# Altium project belt_control.PrjPCB
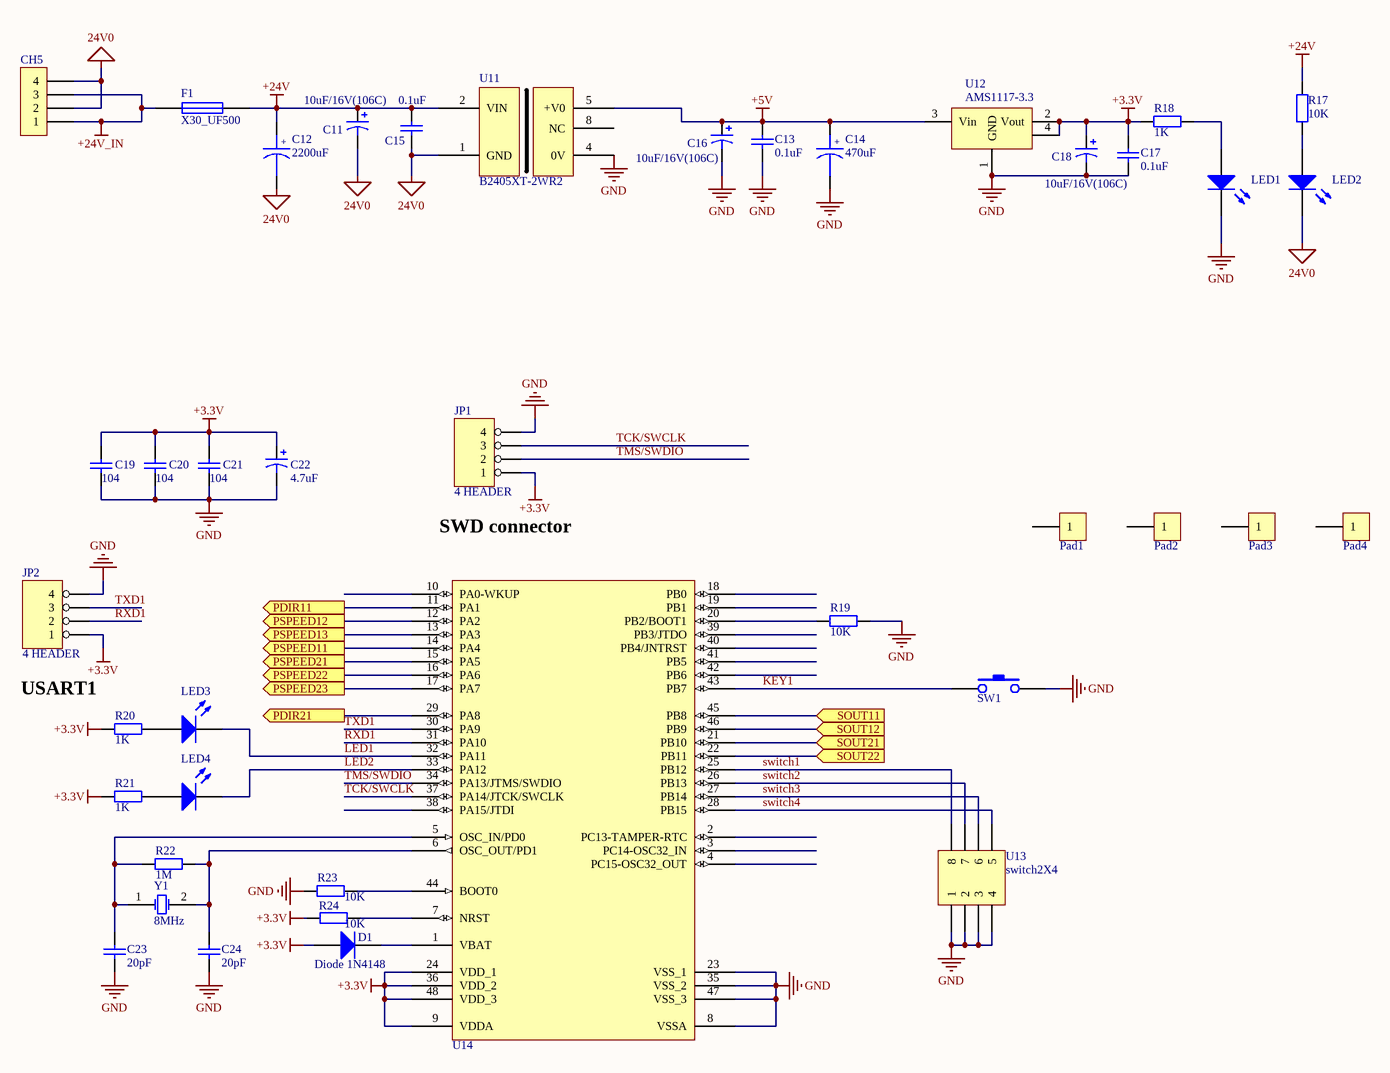
[diagram p0: power_cpu.SchDoc]
3 sheets, 118 parts. Net scope: flat (ports and power ports of the same name join across sheets).
Board file: belt_control.PcbDoc
Sheets:
  power_cpu.SchDoc
  belt_output.SchDoc
  senror_input.SchDoc

## Sheet power_cpu.SchDoc
size A3

### Parts
C11  value 10uF/16V(106C)  [CAP A-3216]  (hidden comment: Cap Pol3)
C12  C_2200uF  [C7.8*17]  (value not drawn)
C13  value 0.1uF  [0805]  (hidden comment: Cap)
C14  C_2200uF  [C5*10]  (value not drawn)
C15  value 0.1uF  [0805]  (hidden comment: Cap)
C16  value 10uF/16V(106C)  [CAP A-3216]  (hidden comment: Cap Pol3)
C17  value 0.1uF  [0805]  (hidden comment: Cap)
C18  value 10uF/16V(106C)  [CAP A-3216]  (hidden comment: Cap Pol3)
C19  value 104  [C0805tan]  (hidden comment: Cap)
C20  value 104  [C0805tan]  (hidden comment: Cap)
C21  value 104  [C0805tan]  (hidden comment: Cap)
C22  value 4.7uF  [3225[1210]]  (hidden comment: Cap Pol1)
C23  value 20pF  [C0805tan]  (hidden comment: Cap)
C24  value 20pF  [C0805tan]  (hidden comment: Cap)
CH5  HEADER1X4  [CH3.96-4PIN]  (value not drawn)
D1  Diode 1N4148  [LL34]
F1  X30_UF500  [X30UF600]
JP1  4 HEADER  [CON4_1.5]
JP2  4 HEADER  [HDR1X4]
LED1  (no value)  [LED-0805]
LED2  (no value)  [LED-0805]
LED3  (no value)  [LED-0805]
LED4  (no value)  [LED-0805]
Pad1  Pad  [pad35]  (value not drawn)
Pad2  Pad  [pad35]  (value not drawn)
Pad3  Pad  [pad35]  (value not drawn)
Pad4  Pad  [pad35]  (value not drawn)
R17  value 10K  [0805]  (hidden comment: Res2)
R18  value 1K  [0805]  (hidden comment: Res2)
R19  value 10K  [C0805tan]  (hidden comment: Res2)
R20  value 1K  [0805]  (hidden comment: Res2)
R21  value 1K  [0805]  (hidden comment: Res2)
R22  value 1M  [C0805tan]  (hidden comment: Res2)
R23  value 10K  [C0805tan]  (hidden comment: Res2)
R24  value 10K  [C0805tan]  (hidden comment: Res2)
SW1  SW-KEY-2  [KEY_SOP4]  (value not drawn)
U11  B2405XT-2WR2  [B2405XT-2WR2]
U12  AMS1117-3.3  [SOT223]
U13  switch2X4  [SOP8_switch]
U14  STM32F103C8T6  [LQFP48]  (value not drawn)
Y1  8MHz  [XTAL_US]

### Ports
PDIR11 (out), PDIR21 (out), PSPEED11 (out), PSPEED12 (out), PSPEED13 (out), PSPEED21 (out), PSPEED22 (out), PSPEED23 (out), SOUT11 (in), SOUT12 (in), SOUT21 (in), SOUT22 (in)

### Nets
24V0: C11.2 C12.2 C15.1 CH5.2 CH5.4 LED2.2(K) U11.1(GND)
+3.3V: C17.2 C18.1 C19.2 C20.2 C21.2 C22.1 D1.1(A) JP1.1 JP2.1 R18.2 R20.2 R21.2 R24.1 U12.2(Vout) U12.4 U14.9(VDDA) U14.24(VDD_1) U14.36(VDD_2) U14.48(VDD_3)
+5V: C13.2 C14.1 C16.1 U11.5(+V0) U12.3(Vin)
+24V: C11.1 C12.1 C15.2 F1.2 R17.2 U11.2(VIN)
+24V_IN: CH5.1 CH5.3 F1.1
GND: C13.1 C14.2 C16.2 C17.1 C18.2 C19.1 C20.1 C21.1 C22.2 C23.1 C24.1 JP1.4 JP2.4 LED1.2(K) R19.2 R23.1 SW1.2 U11.4(0V) U12.1(GND) U13.1 U13.2 U13.3 U13.4 U14.8(VSSA) U14.23(VSS_1) U14.35(VSS_2) U14.47(VSS_3)
KEY1: SW1.1 U14.43(PB7)
LED1: LED3.2(K) U14.32(PA11)
LED2: LED4.2(K) U14.33(PA12)
RXD1: JP2.2 U14.31(PA10)
switch1: U13.8 U14.25(PB12)
switch2: U13.7 U14.26(PB13)
switch3: U13.6 U14.27(PB14)
switch4: U13.5 U14.28(PB15)
TCK/SWCLK: JP1.3 U14.37(PA14/JTCK/SWCLK)
TMS/SWDIO: JP1.2 U14.34(PA13/JTMS/SWDIO)
TXD1: JP2.3 U14.30(PA9)
NetC23_2: C23.2 R22.1 U14.5(OSC_IN/PD0) Y1.1(OSC1)
NetC24_2: C24.2 R22.2 U14.6(OSC_OUT/PD1) Y1.2(OSC2)
NetC26_2: U14.46(PB9) ; port SOUT12
NetC28_2: U14.45(PB8) ; port SOUT11
NetC33_2: U14.22(PB11) ; port SOUT22
NetC35_2: U14.21(PB10) ; port SOUT21
NetD1_2: D1.2(K) U14.1(VBAT)
NetLED1_1: LED1.1(A) R18.1
NetLED2_1: LED2.1(A) R17.1
NetLED3_1: LED3.1(A) R20.1
NetLED4_1: LED4.1(A) R21.1
NetR3_1: U14.14(PA4) ; port PSPEED11
NetR4_1: U14.13(PA3) ; port PSPEED13
NetR7_1: U14.12(PA2) ; port PSPEED12
NetR8_1: U14.11(PA1) ; port PDIR11
NetR11_1: U14.15(PA5) ; port PSPEED21
NetR12_1: U14.17(PA7) ; port PSPEED23
NetR15_1: U14.16(PA6) ; port PSPEED22
NetR16_1: U14.29(PA8) ; port PDIR21
NetR19_1: R19.1 U14.20(PB2/BOOT1)
NetR23_2: R23.2 U14.44(BOOT0)
NetR24_2: R24.2 U14.7(NRST)

Not connected (* = marked no-connect by the designer): Pad1 1; Pad2 1; Pad3 1; Pad4 1; U11 8(NC); U14 2(PC13-TAMPER-RTC) 3(PC14-OSC32_IN) 4(PC15-OSC32_OUT) 10(PA0-WKUP) 18(PB0) 19(PB1) 38(PA15/JTDI) 39(PB3/JTDO) 40(PB4/JNTRST) 41(PB5) 42(PB6)

### Notes on the sheet
- SWD connector
- USART1
- (in symbol C_2200uF) +; 2200uF; 470uF

### Library data of the parts
C11 C16 C18 = Cap Pol3: Polarized Capacitor (Surface Mount); Published: 8-Jun-2000; LatestRevisionDate: 17-Jul-2002; LatestRevisionNote: Re-released for DXP Platform.; PackageReference: C0805; Publisher: Altium Limited
C13 C15 C17 C19-C21 C23 C24 = Cap: Capacitor; Published: 8-Jun-2000; LatestRevisionDate: 17-Jul-2002; LatestRevisionNote: Re-released for DXP Platform.; Publisher: Altium Limited
  C13 C15 C17 C19-C21: PackageReference: RAD-0.3
C22 = Cap Pol1: Polarized Capacitor (Radial); Published: 8-Jun-2000; LatestRevisionDate: 17-Jul-2002; LatestRevisionNote: Re-released for DXP Platform.; PackageReference: RB7.6-15; Publisher: Altium Limited
D1 = Diode 1N4148: High Conductance Fast Diode; Published: 8-Jun-2000; LatestRevisionDate: 17-Jul-2002; LatestRevisionNote: Re-released for DXP Platform.; DatasheetDocument: 1997; PackageReference: DO-35; Publisher: Altium Limited; Code_JEDEC: DO-204-AH; ComponentLink1Description: Manufacturer Link; ComponentLink1URL: http://www.fairchildsemi.com/; ComponentLink2Description: Datasheet; ComponentLink2URL: http://www.fairchildsemi.com/ds/1N%2F1N4148.pdf
F1 = Fuse 1: Fuse; Published: 8-Jun-2000; LatestRevisionDate: 17-Jul-2002; LatestRevisionNote: Re-released for DXP Platform.; PackageReference: PIN-W2/E2.8; Publisher: Altium Limited
JP1 JP2 = 4 HEADER: 4 Pin Header
LED1-LED4 = LED2: Typical RED, GREEN, YELLOW, AMBER GaAs LED; Published: 8-Jun-2000; LatestRevisionDate: 17-Jul-2002; LatestRevisionNote: Re-released for DXP Platform.; PackageDocument: Feb-2002; PackageReference: 3.2X1.6X1.1; Publisher: Altium Limited
R17-R24 = Res2: Resistor; Published: 8-Jun-2000; LatestRevisionDate: 17-Jul-2002; LatestRevisionNote: Re-released for DXP Platform.; Publisher: Altium Limited
  R17 R18 R20 R21: PackageReference: AXIAL-0.4
U12 = AMS1117-5
Y1 = XTAL: Crystal Oscillator; Published: 8-Jun-2000; LatestRevisionDate: 17-Jul-2002; LatestRevisionNote: Re-released for DXP Platform.; Publisher: Altium Limited

## Sheet belt_output.SchDoc
size A3
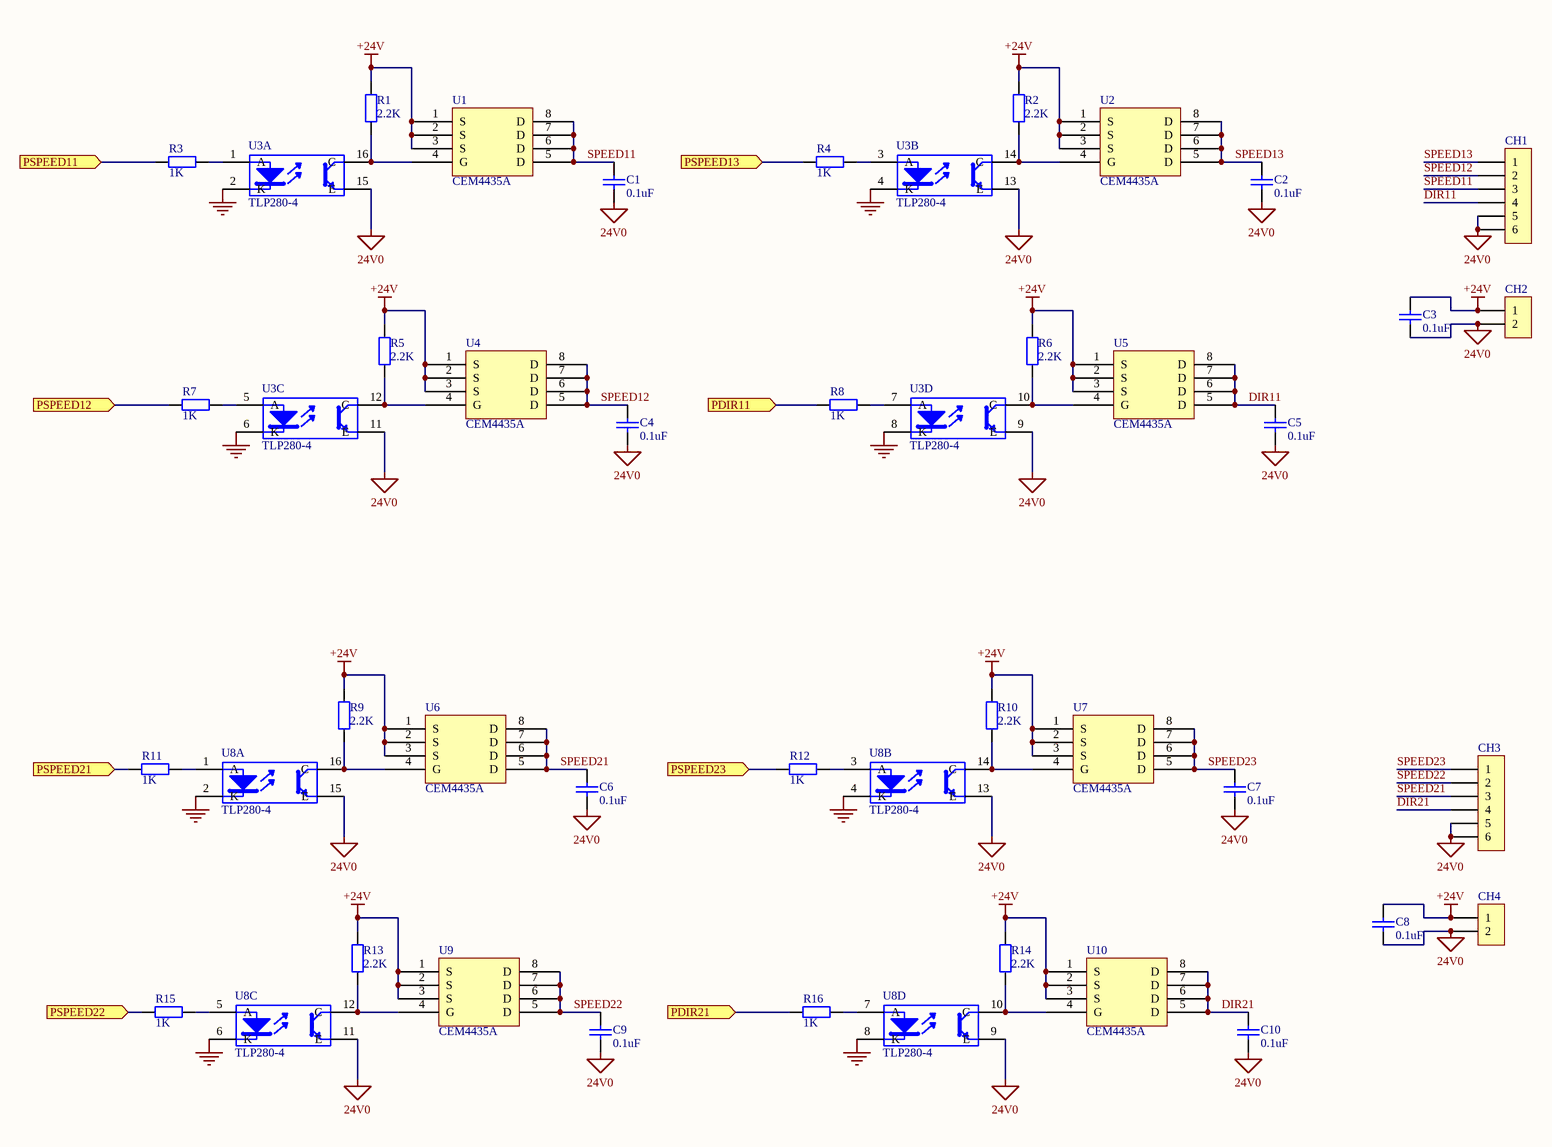
[diagram p1: belt_output.SchDoc]

### Parts
C1  value 0.1uF  [0805]  (hidden comment: Cap)
C2  value 0.1uF  [0805]  (hidden comment: Cap)
C3  value 0.1uF  [0805]  (hidden comment: Cap)
C4  value 0.1uF  [0805]  (hidden comment: Cap)
C5  value 0.1uF  [0805]  (hidden comment: Cap)
C6  value 0.1uF  [0805]  (hidden comment: Cap)
C7  value 0.1uF  [0805]  (hidden comment: Cap)
C8  value 0.1uF  [0805]  (hidden comment: Cap)
C9  value 0.1uF  [0805]  (hidden comment: Cap)
C10  value 0.1uF  [0805]  (hidden comment: Cap)
CH1  HEADER1X6  [CH3.96-6PIN]  (value not drawn)
CH2  HEADER1X2  [CH3.96-2PIN]  (value not drawn)
CH3  HEADER1X6  [CH3.96-6PIN]  (value not drawn)
CH4  HEADER1X2  [CH3.96-2PIN]  (value not drawn)
R1  value 2.2K  [0805]  (hidden comment: Res2)
R2  value 2.2K  [0805]  (hidden comment: Res2)
R3  value 1K  [0805]  (hidden comment: Res2)
R4  value 1K  [0805]  (hidden comment: Res2)
R5  value 2.2K  [0805]  (hidden comment: Res2)
R6  value 2.2K  [0805]  (hidden comment: Res2)
R7  value 1K  [0805]  (hidden comment: Res2)
R8  value 1K  [0805]  (hidden comment: Res2)
R9  value 2.2K  [0805]  (hidden comment: Res2)
R10  value 2.2K  [0805]  (hidden comment: Res2)
R11  value 1K  [0805]  (hidden comment: Res2)
R12  value 1K  [0805]  (hidden comment: Res2)
R13  value 2.2K  [0805]  (hidden comment: Res2)
R14  value 2.2K  [0805]  (hidden comment: Res2)
R15  value 1K  [0805]  (hidden comment: Res2)
R16  value 1K  [0805]  (hidden comment: Res2)
U1  CEM4435A  [SOP8-OP27]
U2  CEM4435A  [SOP8-OP27]
U3  TLP280-4  [SO16]  (parts A,B,C,D of 4)
U4  CEM4435A  [SOP8-OP27]
U5  CEM4435A  [SOP8-OP27]
U6  CEM4435A  [SOP8-OP27]
U7  CEM4435A  [SOP8-OP27]
U8  TLP280-4  [SO16]  (parts A,B,C,D of 4)
U9  CEM4435A  [SOP8-OP27]
U10  CEM4435A  [SOP8-OP27]

### Ports
PDIR11 (in), PDIR21 (in), PSPEED11 (in), PSPEED12 (in), PSPEED13 (in), PSPEED21 (in), PSPEED22 (in), PSPEED23 (in)

### Nets
24V0: C1.2 C2.2 C3.2 C4.2 C5.2 C6.2 C7.2 C8.2 C9.2 C10.2 CH1.5 CH1.6 CH2.2 CH3.5 CH3.6 CH4.2 U3.9(E) U3.11(E) U3.13(E) U3.15(E) U8.9(E) U8.11(E) U8.13(E) U8.15(E)
+24V: C3.1 C8.1 CH2.1 CH4.1 R1.2 R2.2 R5.2 R6.2 R9.2 R10.2 R13.2 R14.2 U1.1(S) U1.2(S) U1.3(S) U2.1(S) U2.2(S) U2.3(S) U4.1(S) U4.2(S) U4.3(S) U5.1(S) U5.2(S) U5.3(S) U6.1(S) U6.2(S) U6.3(S) U7.1(S) U7.2(S) U7.3(S) U9.1(S) U9.2(S) U9.3(S) U10.1(S) U10.2(S) U10.3(S)
GND: U3.2(K) U3.4(K) U3.6(K) U3.8(K) U8.2(K) U8.4(K) U8.6(K) U8.8(K)
DIR11: C5.1 CH1.4 U5.5(D) U5.6(D) U5.7(D) U5.8(D)
DIR21: C10.1 CH3.4 U10.5(D) U10.6(D) U10.7(D) U10.8(D)
SPEED11: C1.1 CH1.3 U1.5(D) U1.6(D) U1.7(D) U1.8(D)
SPEED12: C4.1 CH1.2 U4.5(D) U4.6(D) U4.7(D) U4.8(D)
SPEED13: C2.1 CH1.1 U2.5(D) U2.6(D) U2.7(D) U2.8(D)
SPEED21: C6.1 CH3.3 U6.5(D) U6.6(D) U6.7(D) U6.8(D)
SPEED22: C9.1 CH3.2 U9.5(D) U9.6(D) U9.7(D) U9.8(D)
SPEED23: C7.1 CH3.1 U7.5(D) U7.6(D) U7.7(D) U7.8(D)
NetR1_1: R1.1 U1.4(G) U3.16(C)
NetR2_1: R2.1 U2.4(G) U3.14(C)
NetR3_1: R3.1 ; port PSPEED11
NetR3_2: R3.2 U3.1(A)
NetR4_1: R4.1 ; port PSPEED13
NetR4_2: R4.2 U3.3(A)
NetR5_1: R5.1 U3.12(C) U4.4(G)
NetR6_1: R6.1 U3.10(C) U5.4(G)
NetR7_1: R7.1 ; port PSPEED12
NetR7_2: R7.2 U3.5(A)
NetR8_1: R8.1 ; port PDIR11
NetR8_2: R8.2 U3.7(A)
NetR9_1: R9.1 U6.4(G) U8.16(C)
NetR10_1: R10.1 U7.4(G) U8.14(C)
NetR11_1: R11.1 ; port PSPEED21
NetR11_2: R11.2 U8.1(A)
NetR12_1: R12.1 ; port PSPEED23
NetR12_2: R12.2 U8.3(A)
NetR13_1: R13.1 U8.12(C) U9.4(G)
NetR14_1: R14.1 U8.10(C) U10.4(G)
NetR15_1: R15.1 ; port PSPEED22
NetR15_2: R15.2 U8.5(A)
NetR16_1: R16.1 ; port PDIR21
NetR16_2: R16.2 U8.7(A)

### Library data of the parts
C1-C10 = Cap: Capacitor; Published: 8-Jun-2000; LatestRevisionDate: 17-Jul-2002; LatestRevisionNote: Re-released for DXP Platform.; PackageReference: RAD-0.3; Publisher: Altium Limited
R1-R16 = Res2: Resistor; Published: 8-Jun-2000; LatestRevisionDate: 17-Jul-2002; LatestRevisionNote: Re-released for DXP Platform.; PackageReference: AXIAL-0.4; Publisher: Altium Limited
U3 U8 = TLP521-4

## Sheet senror_input.SchDoc
size A3
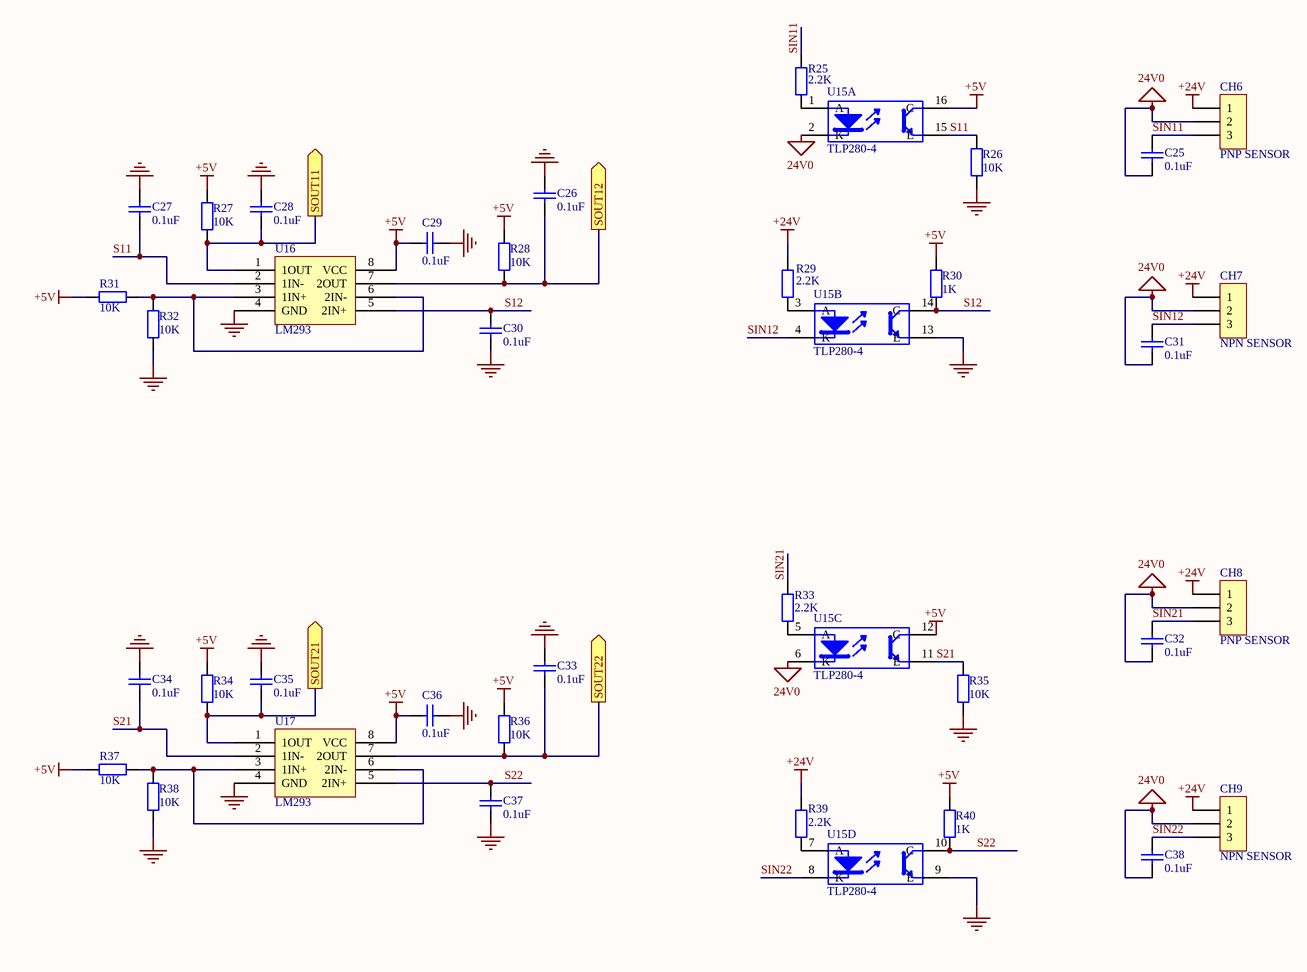
[diagram p2: senror_input.SchDoc]

### Parts
C25  value 0.1uF  [0805]  (hidden comment: Cap)
C26  value 0.1uF  [0805]  (hidden comment: Cap)
C27  value 0.1uF  [0805]  (hidden comment: Cap)
C28  value 0.1uF  [0805]  (hidden comment: Cap)
C29  value 0.1uF  [0805]  (hidden comment: Cap)
C30  value 0.1uF  [0805]  (hidden comment: Cap)
C31  value 0.1uF  [0805]  (hidden comment: Cap)
C32  value 0.1uF  [0805]  (hidden comment: Cap)
C33  value 0.1uF  [0805]  (hidden comment: Cap)
C34  value 0.1uF  [0805]  (hidden comment: Cap)
C35  value 0.1uF  [0805]  (hidden comment: Cap)
C36  value 0.1uF  [0805]  (hidden comment: Cap)
C37  value 0.1uF  [0805]  (hidden comment: Cap)
C38  value 0.1uF  [0805]  (hidden comment: Cap)
CH6  HEADER1X3  [CH3.96-3PIN]  (value not drawn)
CH7  HEADER1X3  [CH3.96-3PIN]  (value not drawn)
CH8  HEADER1X3  [CH3.96-3PIN]  (value not drawn)
CH9  HEADER1X3  [CH3.96-3PIN]  (value not drawn)
R25  value 2.2K  [0805]  (hidden comment: Res2)
R26  value 10K  [0805]  (hidden comment: Res2)
R27  value 10K  [0805]  (hidden comment: Res2)
R28  value 10K  [0805]  (hidden comment: Res2)
R29  value 2.2K  [0805]  (hidden comment: Res2)
R30  value 1K  [0805]  (hidden comment: Res2)
R31  value 10K  [0805]  (hidden comment: Res2)
R32  value 10K  [0805]  (hidden comment: Res2)
R33  value 2.2K  [0805]  (hidden comment: Res2)
R34  value 10K  [0805]  (hidden comment: Res2)
R35  value 10K  [0805]  (hidden comment: Res2)
R36  value 10K  [0805]  (hidden comment: Res2)
R37  value 10K  [0805]  (hidden comment: Res2)
R38  value 10K  [0805]  (hidden comment: Res2)
R39  value 2.2K  [0805]  (hidden comment: Res2)
R40  value 1K  [0805]  (hidden comment: Res2)
U15  TLP280-4  [SO16]  (parts A,B,C,D of 4)
U16  LM293  [SOP8-OP27]
U17  LM293  [SOP8-OP27]

### Ports
SOUT11 (out), SOUT12 (out), SOUT21 (out), SOUT22 (out)

### Nets
24V0: C25.2 C31.2 C32.2 C38.2 CH6.2 CH7.2 CH8.2 CH9.2 U15.2(K) U15.6(K)
+5V: C29.2 C36.2 R27.1 R28.1 R30.1 R31.1 R34.1 R36.1 R37.1 R40.1 U15.12(C) U15.16(C) U16.8(VCC) U17.8(VCC)
+24V: CH6.1 CH7.1 CH8.1 CH9.1 R29.1 R39.1
GND: C26.1 C27.1 C28.1 C29.1 C30.1 C33.1 C34.1 C35.1 C36.1 C37.1 R26.2 R32.2 R35.2 R38.2 U15.9(E) U15.13(E) U16.4(GND) U17.4(GND)
S11: C27.2 R26.1 U15.15(E) U16.2(1IN-)
S12: C30.2 R30.2 U15.14(C) U16.5(2IN+)
S21: C34.2 R35.1 U15.11(E) U17.2(1IN-)
S22: C37.2 R40.2 U15.10(C) U17.5(2IN+)
SIN11: C25.1 CH6.3 R25.1
SIN12: C31.1 CH7.3 U15.4(K)
SIN21: C32.1 CH8.3 R33.1
SIN22: C38.1 CH9.3 U15.8(K)
NetC26_2: C26.2 R28.2 U16.7(2OUT) ; port SOUT12
NetC28_2: C28.2 R27.2 U16.1(1OUT) ; port SOUT11
NetC33_2: C33.2 R36.2 U17.7(2OUT) ; port SOUT22
NetC35_2: C35.2 R34.2 U17.1(1OUT) ; port SOUT21
NetR25_2: R25.2 U15.1(A)
NetR29_2: R29.2 U15.3(A)
NetR31_2: R31.2 R32.1 U16.3(1IN+) U16.6(2IN-)
NetR33_2: R33.2 U15.5(A)
NetR37_2: R37.2 R38.1 U17.3(1IN+) U17.6(2IN-)
NetR39_2: R39.2 U15.7(A)

### Notes on the sheet
- (in symbol HEADER1X3) PNP SENSOR; NPN SENSOR

### Library data of the parts
C25-C38 = Cap: Capacitor; Published: 8-Jun-2000; LatestRevisionDate: 17-Jul-2002; LatestRevisionNote: Re-released for DXP Platform.; PackageReference: RAD-0.3; Publisher: Altium Limited
R25-R40 = Res2: Resistor; Published: 8-Jun-2000; LatestRevisionDate: 17-Jul-2002; LatestRevisionNote: Re-released for DXP Platform.; PackageReference: AXIAL-0.4; Publisher: Altium Limited
U15 = TLP521-4

## Nets that join several sheets
24V0: power_cpu (7 pins), belt_output (24 pins), senror_input (10 pins)
+5V: power_cpu (5 pins), senror_input (14 pins)
+24V: power_cpu (6 pins), belt_output (36 pins), senror_input (6 pins)
GND: power_cpu (27 pins), belt_output (8 pins), senror_input (18 pins)
NetC26_2: power_cpu (U14.46), senror_input (C26.2 R28.2 U16.7)
NetC28_2: power_cpu (U14.45), senror_input (C28.2 R27.2 U16.1)
NetC33_2: power_cpu (U14.22), senror_input (C33.2 R36.2 U17.7)
NetC35_2: power_cpu (U14.21), senror_input (C35.2 R34.2 U17.1)
NetR3_1: power_cpu (U14.14), belt_output (R3.1)
NetR4_1: power_cpu (U14.13), belt_output (R4.1)
NetR7_1: power_cpu (U14.12), belt_output (R7.1)
NetR8_1: power_cpu (U14.11), belt_output (R8.1)
NetR11_1: power_cpu (U14.15), belt_output (R11.1)
NetR12_1: power_cpu (U14.17), belt_output (R12.1)
NetR15_1: power_cpu (U14.16), belt_output (R15.1)
NetR16_1: power_cpu (U14.29), belt_output (R16.1)